# EAGLE design ChristmasTree (EAGLE 6.5.0)
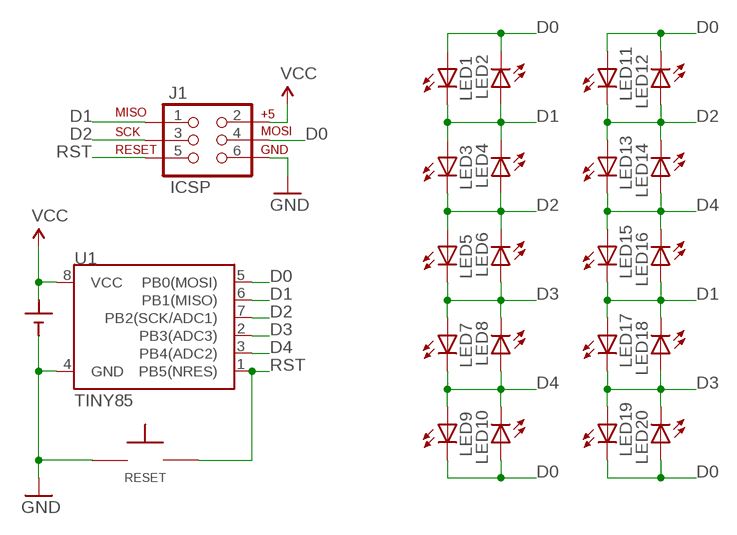
[diagram p0: schematic, sheet 1]

## Parts
BATT  CR2032  BATTCR2032_THRU  [CR2032-THRU]
J1  ICSP  AVR_SPI_PRG_6LABELED  [2X3-NS]
LED1  LED5MM  [LED5MM]
LED2  LED5MM  [LED5MM]
LED3  LED5MM  [LED5MM]
LED4  LED5MM  [LED5MM]
LED5  LED5MM  [LED5MM]
LED6  LED5MM  [LED5MM]
LED7  LED5MM  [LED5MM]
LED8  LED5MM  [LED5MM]
LED9  LED5MM  [LED5MM]
LED10  LED5MM  [LED5MM]
LED11  LED5MM  [LED5MM]
LED12  LED5MM  [LED5MM]
LED13  LED5MM  [LED5MM]
LED14  LED5MM  [LED5MM]
LED15  LED5MM  [LED5MM]
LED16  LED5MM  [LED5MM]
LED17  LED5MM  [LED5MM]
LED18  LED5MM  [LED5MM]
LED19  LED5MM  [LED5MM]
LED20  LED5MM  [LED5MM]
RESET  TAC_SPST_NO  [TAC_SPST_NO]
U1  TINY85  ATTINY45TINY85-20-DIP  [DIP08]

## Nets
D0: J1.4(MOSI) LED1.A LED2.K(C) LED9.K(C) LED10.A LED11.A LED12.K(C) LED19.K(C) LED20.A U1.5(PB0(MOSI))
D1: J1.1(MISO) LED1.K(C) LED2.A LED3.A LED4.K(C) LED15.K(C) LED16.A LED17.A LED18.K(C) U1.6(PB1(MISO))
D2: J1.3(SCK) LED3.K(C) LED4.A LED5.A LED6.K(C) LED11.K(C) LED12.A LED13.A LED14.K(C) U1.7(PB2(SCK/ADC1))
D3: LED5.K(C) LED6.A LED7.A LED8.K(C) LED17.K(C) LED18.A LED19.A LED20.K(C) U1.2(PB3(ADC3))
D4: LED7.K(C) LED8.A LED9.A LED10.K(C) LED13.K(C) LED14.A LED15.A LED16.K(C) U1.3(PB4(ADC2))
GND: BATT.- J1.6(GND) RESET.P$1 U1.4(GND)
RST: J1.5(RST) RESET.P$2 U1.1(PB5(NRES))
VCC: BATT.+1(+) J1.2(V+) U1.8(VCC)

## Library data of the parts
BATT = battery:BATT
J1 = barbary_enterprises:AVR_SPI_PRG_6: AVR ISP 6 Pin This is the reduced ISP connector for AVR programming. Common on Arduino. This footprint will take up less PCB space and can be used with a 10-pin to 6-pin adapter such as SKU: BOB-08508
LED1-LED20 = barbary_enterprises:LED: LEDs Standard schematic elements and footprints for 5mm, 3mm, 1206, and 0603 sized LEDs. 5mm - Spark Fun Electronics SKU : COM-00529 (and others)
RESET = barbary_enterprises:TAC_SPST_NO: 3,5 mm Tact Switches C&K PTS635 Series * Digi-Key Part Number: CKN9102-ND
U1 = SparkFun-DigitalIC:ATTINY45: Atmel 8-pin 2/4/8kB flash uC; PROD_ID: IC-09445; VALUE: TINY85-20-DIP

## Board
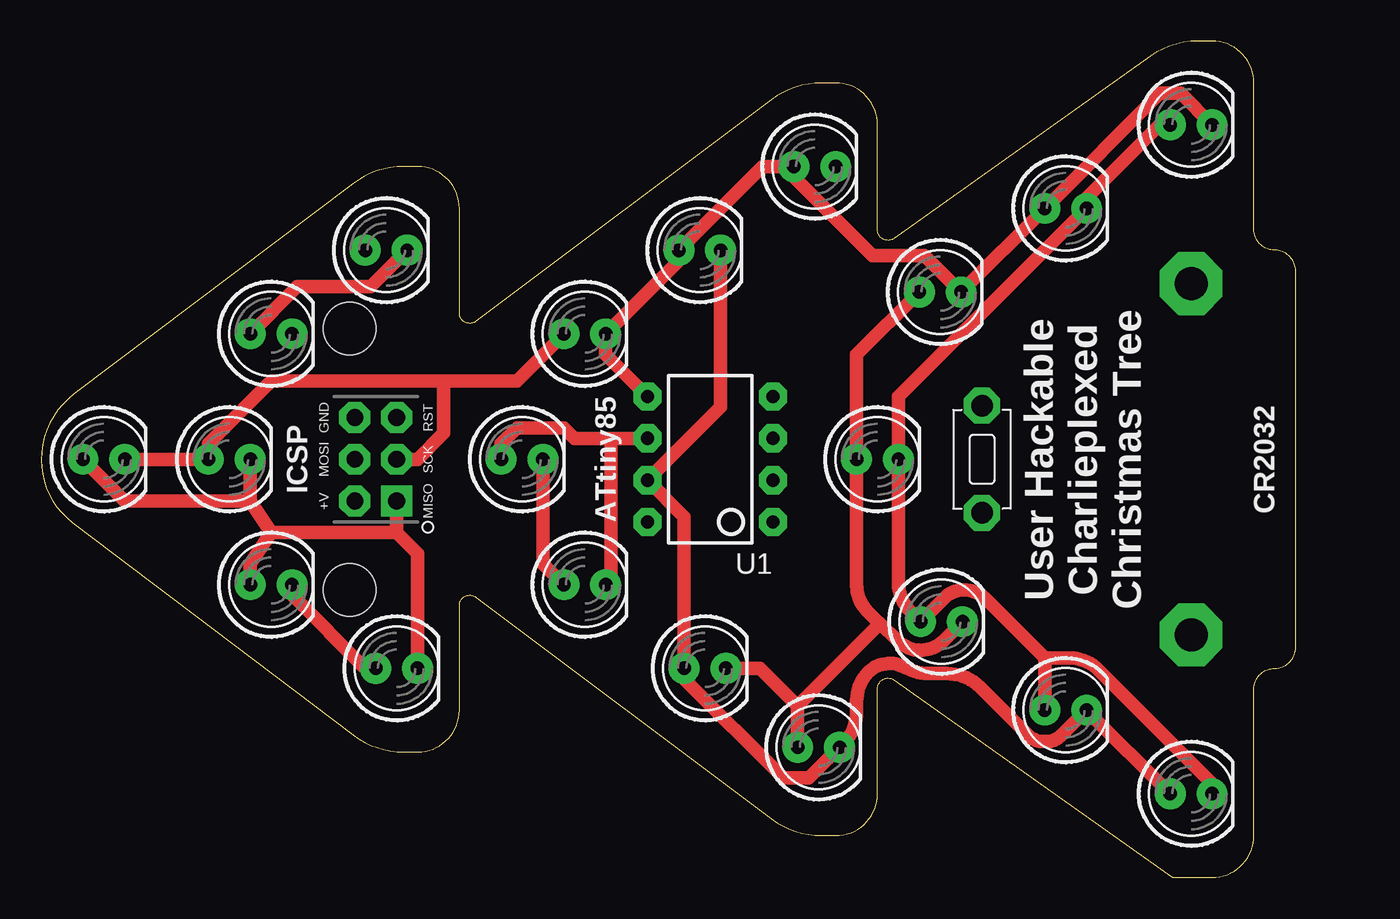
[diagram p1: board, top side]
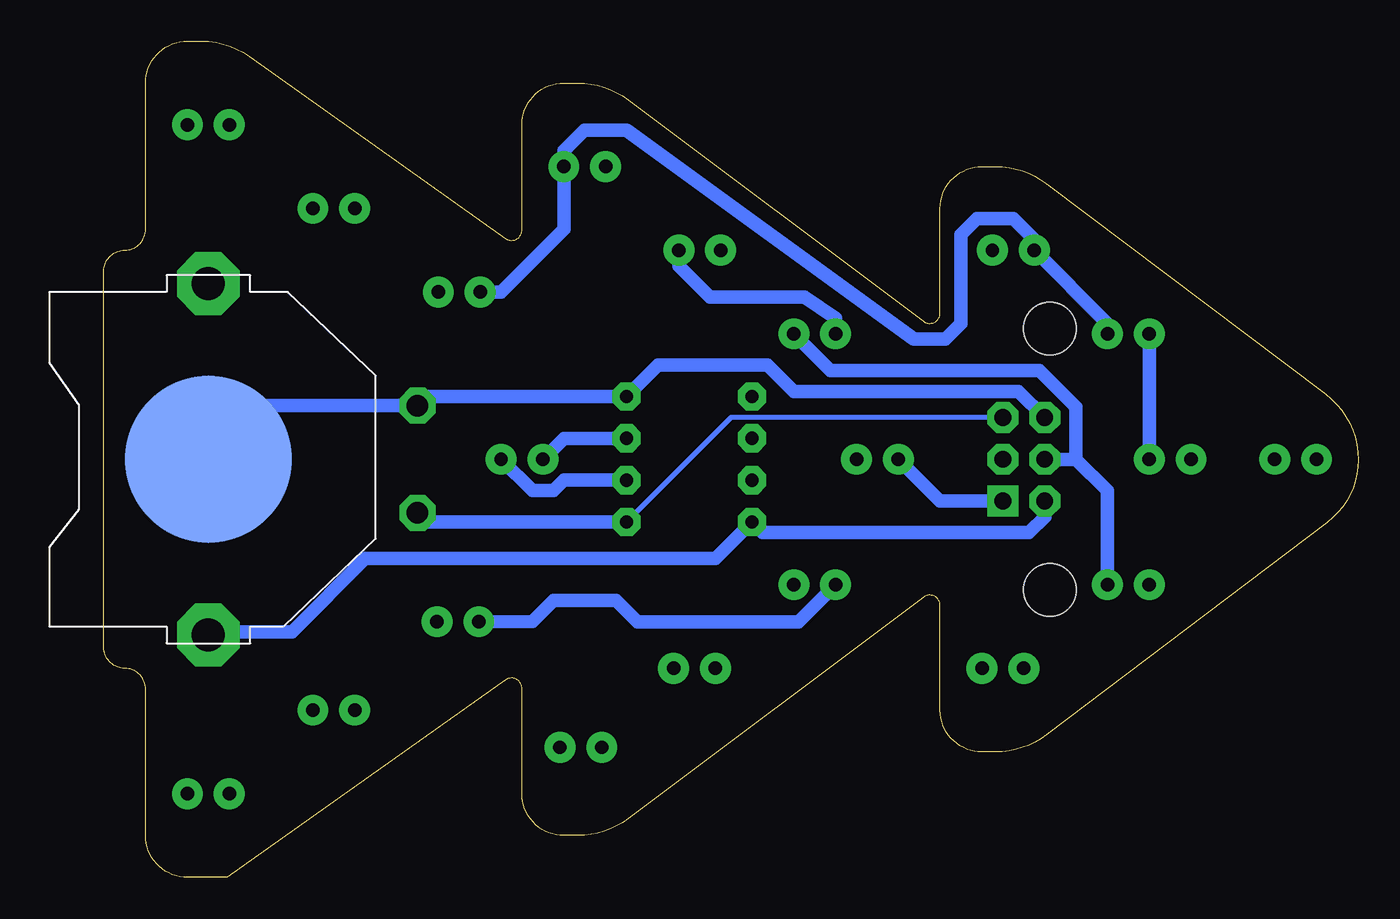
[diagram p2: board, bottom side, seen from below]

Size 76.2 x 50.8 mm. Coordinates in mm from the lower left corner, seen from the top.
Outline: 18.96,42.16 1.99,29.36 arc53 0,25.37 arc53 1.89,21.57 18.96,8.65 arc37 22.03,7.62 22.86,7.62 arc90 25.4,10.16 25.4,16.51 arc-127 26.42,17.02 44.37,3.56 arc37 47.41,2.54 48.26,2.54 arc90 50.8,5.08 50.8,11.47 arc-125 51.8,11.99 68.72,0 71.12,0 arc90 73.66,2.54 73.66,11.43 arc-90 74.93,12.7 arc90 76.2,13.97 76.2,36.83 arc90 74.93,38.1 arc-90 73.66,39.37 73.66,48.26 arc90 71.12,50.8 70.26,50.8 arc35 67.36,49.88 51.8,38.81 arc-125 50.8,39.33 50.8,45.72 arc90 48.26,48.26 47.41,48.26 arc37 44.37,47.24 26.42,33.78 arc-127 25.4,34.29 25.4,40.64 arc90 22.86,43.18 22.02,43.18 arc37 18.96,42.16
Copper layers (1*16): Top 0.0356mm / dielectric 1.5011mm / Bottom 0.0356mm
Design rules "LaenPCBOrder": minimum track width 6mil, minimum drill 13mil, track to track 6mil, track to pad 6mil, pad to pad 6mil, via to via 6mil, smd to smd 6mil, copper to edge 15mil, drill to drill 6mil, minimum pad ring 7mil, minimum via ring 7mil, stop-mask expansion 3mil, vias tented up to drill 0mil, thermal gap 10mil
Holes 3.17 mm at 18.73,33.34 18.73,17.46

### Footprints (pad centres in the part's own frame; a part is rotated, then mirrored left to right if it is on the bottom)
CR2032-THRU = drill 2 pad 3.81 octagon: +1 -10.668,0; +2 10.668,0 | smd 10.16 x 10.16: - 0,0
2X3-NS = drill 1.016 pad 1.88 square: 1 -2.54,-1.27 | drill 1.016 pad 1.88 octagon: 2 -2.54,1.27; 3 0,-1.27; 4 0,1.27; 5 2.54,-1.27; 6 2.54,1.27
LED5MM = drill 0.813 pad 1.88: A -1.27,0; K 1.27,0
TAC_SPST_NO = drill 1.3 pad 2.184 octagon: P$1 -3.251,0; P$2 3.251,0
DIP08 = drill 0.813 pad 1.727 octagon: 1 -3.81,-3.81; 2 -1.27,-3.81; 3 1.27,-3.81; 4 3.81,-3.81; 5 3.81,3.81; 6 1.27,3.81; 7 -1.27,3.81; 8 -3.81,3.81

### Placement (x,y rotation side)
BATT  69.85,25.4 90 bottom
J1  20.32,25.4 90 top
LED1  21.59,12.7 0 top
LED2  13.97,17.78 0 top
LED3  3.81,25.4 0 top
LED4  11.43,25.4 0 top
LED5  69.85,5.08 0 top
LED6  62.23,10.16 0 top
LED7  54.69,15.53 0 top
LED8  50.8,25.4 0 top
LED9  54.61,35.56 0 top
LED10  46.99,43.18 0 top
LED11  40.01,38.1 0 top
LED12  33.02,33.02 0 top
LED13  40.32,12.7 0 top
LED14  47.22,7.9 0 top
LED15  20.95,38.1 0 top
LED16  13.97,33.02 0 top
LED17  29.21,25.4 0 top
LED18  33.02,17.78 0 top
LED19  69.85,45.72 0 top
LED20  62.23,40.64 0 top
RESET  57.15,25.4 270 top
U1  40.64,25.4 90 top

### Tracks (layer width: path | path; a pad name or v marks a point on that pad's centre or on a via)
D0
  Top 0.813: LED19.K 69.22,47.62 67.94,47.62 LED20.A LED9.K 53.66,37.78 50.48,37.78 45.72,42.55 LED10.A 43.81,43.18 LED11.A 38.73,37.47 LED12.K 34.29,31.75 U1.5 | LED2.K 15.24,17.14 19.68,12.7 LED1.A
  Bottom 0.813: LED2.K 15.24,23.5 17.14,25.4 | J1.4 17.14,25.4 | 17.14,25.4 17.14,28.57 19.37,30.8 32.07,30.8 LED12.K
D1
  Top 0.813: 34.61,26.67 32.38,26.67 31.75,27.3 28.89,27.3 27.94,26.35 LED17.A | U1.6 34.61,26.67 | 34.61,26.67 34.61,18.1 LED18.K | LED15.K 20,35.88 15.56,35.88 LED16.A | 21.59,20.95 13.97,20.95 | 13.97,20.95 12.7,22.86 | 12.7,22.86 LED4.K | LED2.A 12.7,19.05 13.97,20.95 | LED1.K 22.86,19.68 21.59,20.95 | 21.59,20.95 J1.1 | LED3.A 5.08,22.86 12.7,22.86
  Bottom 0.813: J1.1 25.4,22.86 LED17.A | LED16.A LED4.K
D2
  Top 0.813: LED5.A LED6.K 61.97,8.63 arc-45 61.07,8.26 60.85,8.26 arc-45 59.95,8.63 57.03,11.55 arc45 55.01,12.38 53.84,12.38 arc-23 52.88,12.58 52.23,12.86 arc68 50.26,12.47 arc45 49.53,10.72 49.53,10.08 arc-45 48.72,8.13 LED14.K 46.62,6.03 45.09,6.03 39.05,12.06 LED13.A 39.05,21.91 U1.7 41.27,28.57 LED11.K | LED3.K LED4.A 10.16,26.35 13.97,30.16 24.45,30.16 | 24.45,30.16 28.89,30.16 LED12.A | J1.3 22.86,25.4 24.45,26.99 24.45,30.16
  Bottom 0.813: LED12.A 31.75,33.97 33.66,35.24 39.37,35.24 41.27,37.15 LED11.K
D3
  Top 0.813: 60.96,13.34 57.39,16.91 arc45 56.04,17.46 55.96,17.46 arc45 54.92,17.03 LED7.A 52.81,16.15 arc-45 52.07,17.92 LED8.K 52.07,29.21 LED20.K 63.5,41.27 67.94,45.72 LED19.A | 60.96,13.34 LED6.A | LED5.K 71.12,5.71 64.25,12.59 arc45 62.44,13.34 60.96,13.34 | LED17.K 30.48,19.05 LED18.A
  Bottom 0.813: U1.2 48.26,24.13 48.9,23.5 50.16,23.5 LED8.K | LED18.A 34,15.53 43.79,15.53 45.09,16.83 48.9,16.83 50.16,15.56 LED7.A
D4
  Top 0.813: 50.96,15.42 50.8,15.56 50.19,16.17 arc-45 49.53,17.76 LED8.A 49.53,31.75 LED9.A | 50.96,15.42 52.06,14.35 arc89 54.8,14.37 LED7.K | 45.95,10.41 50.96,15.42 | 45.95,10.41 LED14.A | LED13.K 43.66,12.7 45.95,10.41
  Bottom 0.813: U1.3 48.26,26.67 LED8.A | LED9.A 52.07,35.56 48.26,39.37 LED10.K 48.26,44.13 46.99,45.4 44.45,45.4 26.99,32.7 25.08,32.7 24.13,33.66 24.13,39.05 23.18,40.01 20.95,40.01 19.68,38.73 LED15.A 15.24,33.66 LED16.K
GND
  Bottom 0.813: BATT.- 66.6,28.65 RESET.P$1 56.59,29.21 U1.4 42.55,31.11 35.88,31.11 34.29,29.53 20.64,29.53 J1.6
RST
  Bottom 0.305: J1.5 38.1,27.94 U1.1
  Bottom 0.813: U1.1 56.59,21.59 RESET.P$2
VCC
  Bottom 0.813: BATT.+1 69.66,14.92 64.77,14.92 60.33,19.37 39.05,19.37 U1.8 36.2,20.95 20,20.95 19.05,21.91 J1.2

### Text on the board
tPlace: ICSP | ATtiny85 | User Hackable / Charlieplexed / Christmas Tree | CR2032